# EAGLE design 1-WireDualCounter (EAGLE 6.5.0)
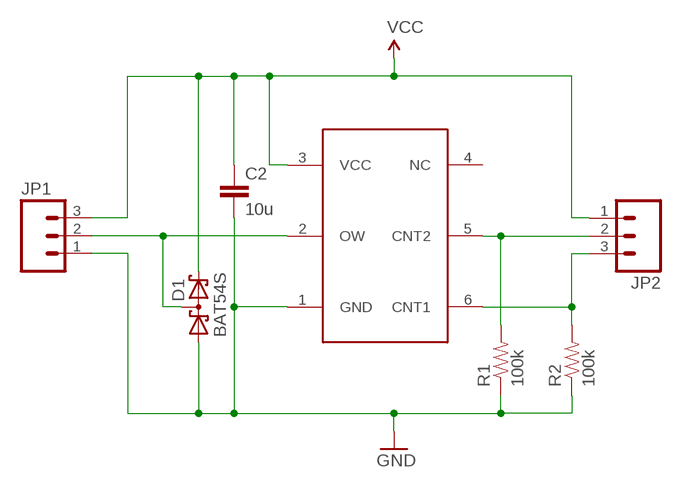
[diagram p0: schematic, sheet 1]

## Parts
C2  10u  CAP0603-CAP  [0603-CAP]
D1  BAT54S  [SOT23]
JP1  M03LOCK  [1X03_LOCK]
JP2  M03LOCK  [1X03_LOCK]
R1  100k  RESISTOR0603-RES  [0603-RES]
R2  100k  RESISTOR0603-RES  [0603-RES]
U$2  DS2423P  [TSOC6]

## Nets
GND: C2.2 D1.1(A1) JP1.1 R1.1 R2.1 U$2.1(GND)
N$1: D1.3(C1A2) JP1.2 U$2.2(OW)
N$4: JP2.2 R1.2 U$2.5(CNT2)
N$5: JP2.3 R2.2 U$2.6(CNT1)
VCC: C2.1 D1.2(C2) JP1.3 JP2.1 U$2.3(VCC)
Unconnected: U$2.4(NC)

## Library data of the parts
C2 = SparkFun-Capacitors:CAP: Capacitor Standard 0603 ceramic capacitor, and 0.1" leaded capacitor.
D1 = diode:BAT54S: Schottky Diodes Pin connection corrected 2011-05-04 Source: Fairchild .. BAT54.pdf
JP1 JP2 = SparkFun:M03: Header 3 Standard 3-pin 0.1" header. Use with straight break away headers (SKU : PRT-00116), right angle break away headers (PRT-00553), swiss pins (PRT-00743), machine pins (PRT-00117), and female headers (PRT-00115). Molex polarized connector foot print use with SKU : PRT-08232 with associated crimp pins and housings.
R1 R2 = SparkFun-Resistors:RESISTOR: Resistor Basic schematic elements and footprints for 0603, 1206, and PTH resistors.
U$2 = 1wire:DS2423P

## Board
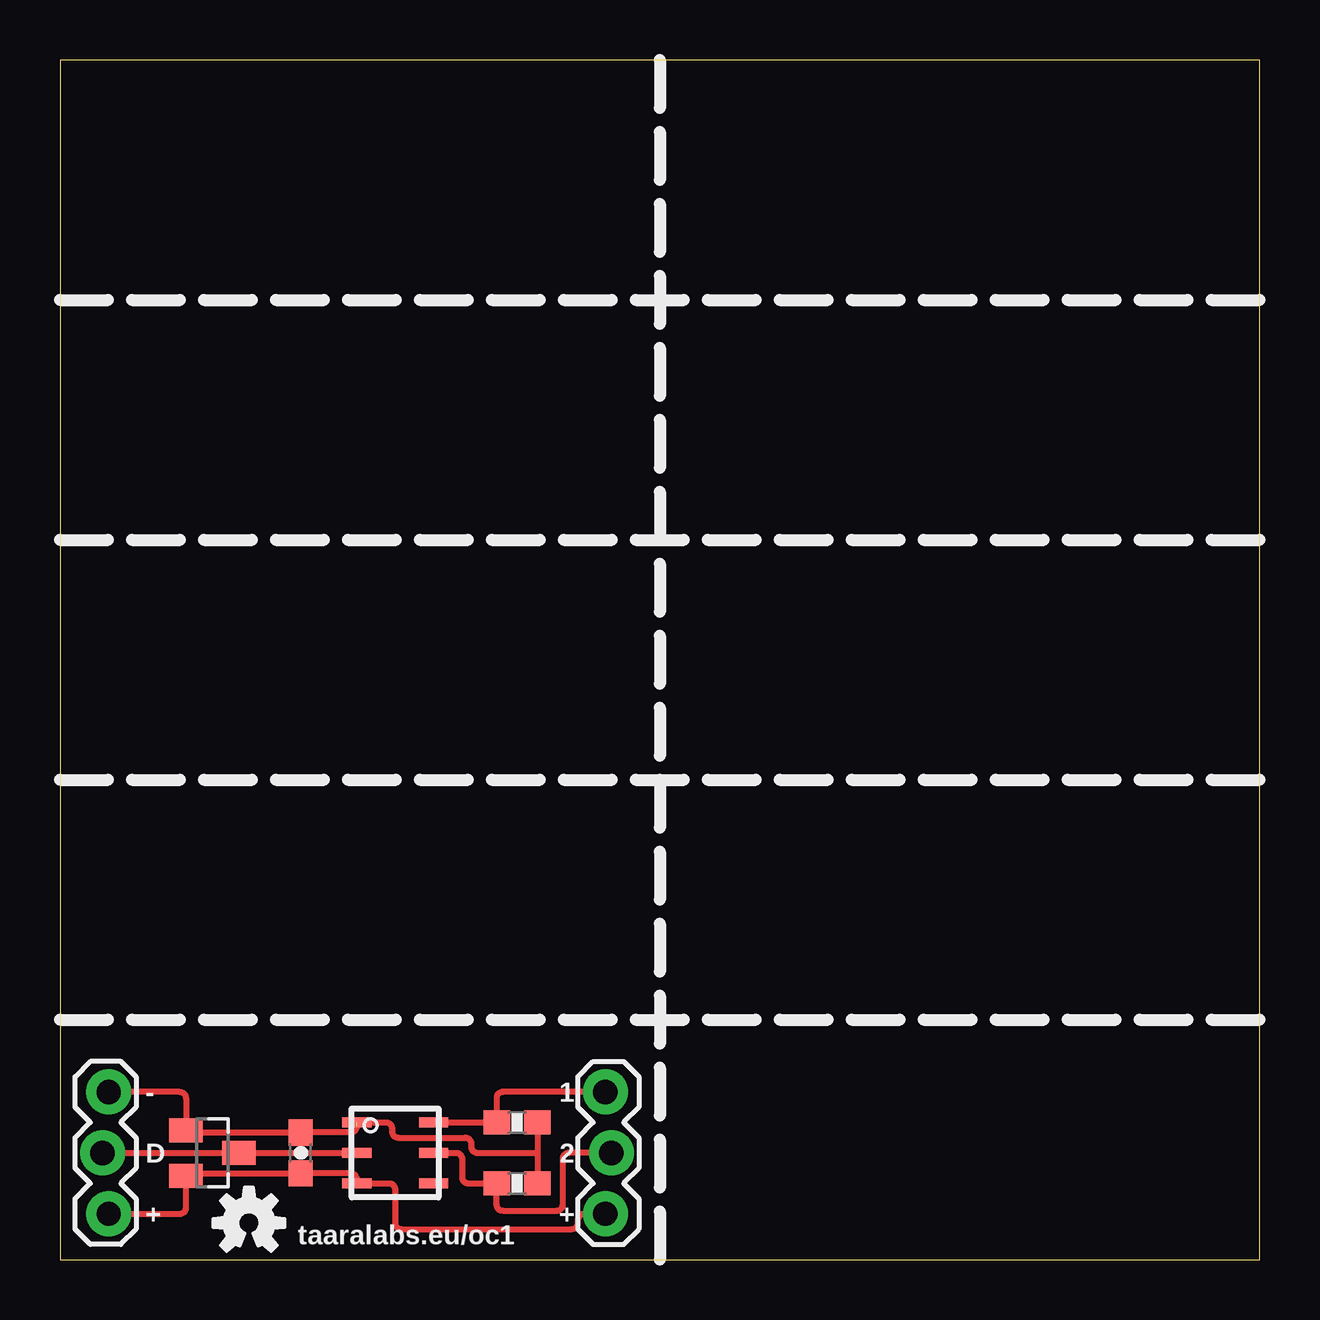
[diagram p1: board, top side]

Size 50 x 50 mm. Coordinates in mm from the lower left corner, seen from the top.
Outline: 50,0 50,50 0,50 0,0 50,0
Copper layers (1*16): Top 0.035mm / dielectric 1.5mm / Bottom 0.035mm
Design rules "default": minimum track width 10mil, minimum drill 24mil, track to track 8mil, track to pad 8mil, pad to pad 8mil, via to via 8mil, smd to smd 8mil, copper to edge 40mil, drill to drill 8mil, minimum pad ring 10mil, minimum via ring 8mil, stop-mask expansion 4mil, vias tented up to drill 0mil, thermal gap 10mil

### Footprints (pad centres in the part's own frame; a part is rotated, then mirrored left to right if it is on the bottom)
0603-CAP = smd 1.1 x 1: 1 -0.85,0; 2 0.85,0
SOT23 = smd 1 x 1.4: 1 -0.95,-1.1; 2 0.95,-1.1; 3 0,1.1
1X03_LOCK = drill 1.016 pad 1.88: 1 0,0.127; 2 2.54,-0.127; 3 5.08,0.127
0603-RES = smd 1.1 x 1: 1 -0.85,0; 2 0.85,0
TSOC6 = smd 0.406 x 1.219: 1 -1.27,-1.6; 2 0,-1.6; 3 1.27,-1.6; 4 1.27,1.6; 5 0,1.6; 6 -1.27,1.6

### Placement (x,y rotation side)
C2  10.03,4.45 90 top
D1  6.35,4.45 270 top
JP1  1.91,6.99 270 top
JP2  22.86,1.91 90 top
R1  19.05,3.17 180 top
R2  19.05,5.71 180 top
U$1  [OSHW-LOGO-S]  7.87,1.52 0 top
U$2  13.97,4.45 270 top

### Tracks (layer width: path | path; a pad name or v marks a point on that pad's centre or on a via)
GND  (1 unrouted)
  Top 0.254: 12.37,5.55 arc-90 12.12,5.29 C2.2 5.35,5.29 arc-90 D1.1 5.25,6.73 arc90 5,6.99 JP1.1 | R2.1 19.9,4.45 | 19.9,4.45 R1.1 | U$2.1 13.59,5.71 arc-90 13.84,5.46 13.84,5.33 arc90 14.1,5.08 16.89,5.08 arc-90 17.14,4.83 17.14,4.7 arc90 17.4,4.45 19.9,4.45
N$1
  Top 0.254: JP1.2 D1.3 U$2.2
N$4
  Top 0.254: JP2.2 21.21,4.45 arc90 20.95,4.19 20.95,2.29 arc-90 20.7,2.03 18.45,2.03 arc-90 18.2,2.29 R1.2 17.02,3.17 arc-90 16.76,3.43 16.76,4.19 arc90 16.51,4.45 U$2.5
N$5
  Top 0.254: U$2.6 R2.2 18.2,6.73 arc-90 18.45,6.99 JP2.3
VCC
  Top 0.254: JP2.1 21.84,1.91 arc90 21.59,1.65 21.59,1.52 arc-90 21.34,1.27 14.22,1.27 arc-90 13.97,1.52 13.97,2.92 arc90 13.72,3.17 U$2.3 12.37,3.34 arc90 12.12,3.6 C2.1 5.35,3.6 arc90 D1.2 5.25,2.16 arc-90 5,1.91 JP1.3

### Text on the board
tNames: - | 1 | D | 2 | + | + | taaralabs.eu/oc1